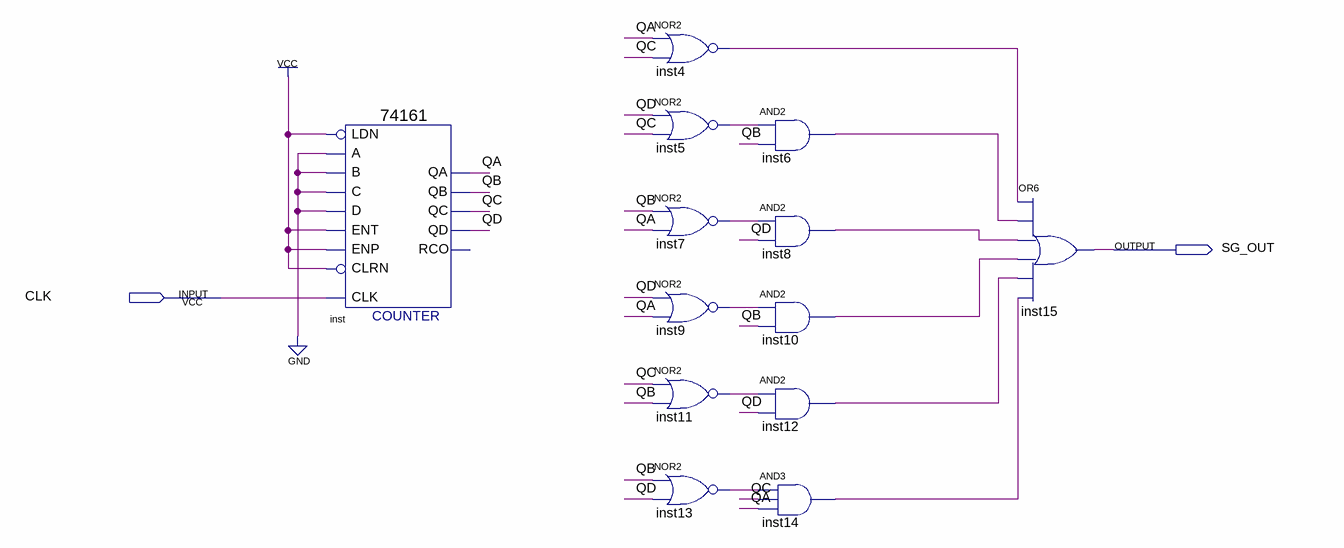
[diagram p0: schematic sheet]
// Quartus schematic Sequence_Generator.bdf as structural Verilog: 13 symbols, 2 pins
module Sequence_Generator (
  input  CLK,
  output SG_OUT
);

  wire inst4_out, inst5_out, inst6_out, inst7_out, inst8_out, inst9_out, inst10_out, inst11_out, inst12_out,
       inst13_out, inst14_out, QA, QB, QC, QD;

  \74161  inst (
    .CLRN(1'b1), .CLK(CLK), .ENP(1'b1), .LDN(1'b1), .A(1'b0), .D(1'b0), .ENT(1'b1), .B(1'b0), .C(1'b0),
    .QD(QD), .QC(QC), .QB(QB), .QA(QA));  // open: RCO
  nor inst4 (inst4_out, QA, QC);
  nor inst5 (inst5_out, QD, QC);
  nor inst7 (inst7_out, QB, QA);
  nor inst9 (inst9_out, QD, QA);
  nor inst11 (inst11_out, QC, QB);
  nor inst13 (inst13_out, QB, QD);
  and inst6 (inst6_out, inst5_out, QB);
  and inst8 (inst8_out, inst7_out, QD);
  and inst10 (inst10_out, inst9_out, QB);
  and inst12 (inst12_out, inst11_out, QD);
  and inst14 (inst14_out, inst13_out, QC, QA);
  or inst15 (SG_OUT, inst4_out, inst6_out, inst8_out, inst10_out, inst12_out, inst14_out);
endmodule
